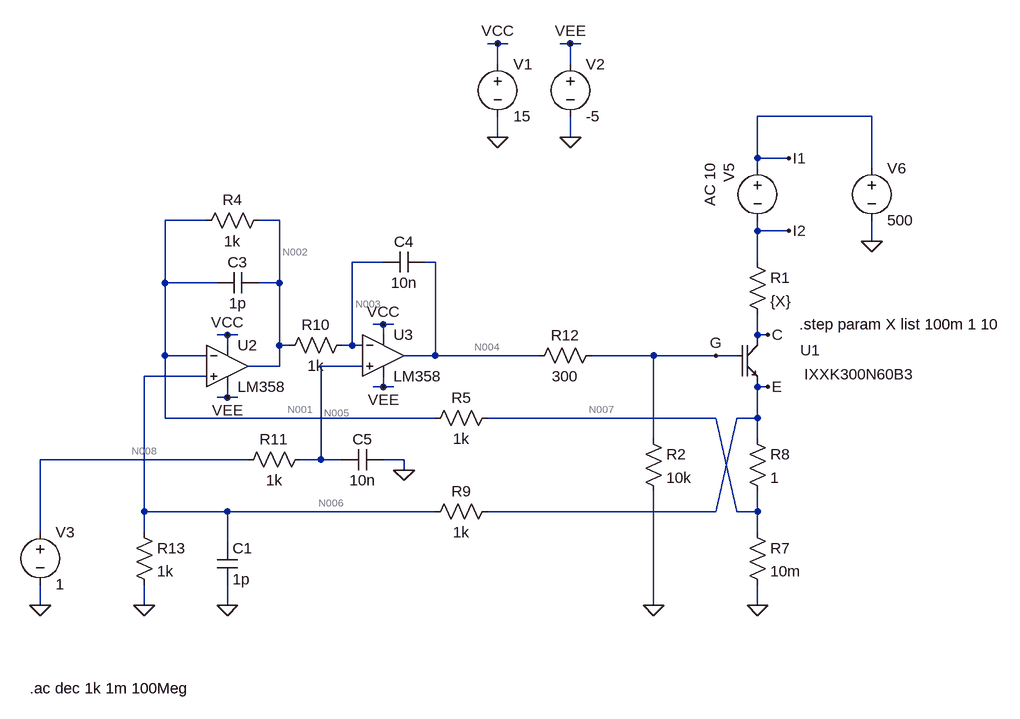
[diagram p0: schematic ConstantCurrentOutputFrequencyResponse.asc]
ConstantCurrentOutputFrequencyResponse.asc, the LTspice schematic file:
Version 4
SHEET 1 880 980
WIRE -160 -336 -176 -336
WIRE -144 -336 -160 -336
WIRE -48 -336 -64 -336
WIRE -32 -336 -48 -336
WIRE -160 -304 -160 -336
WIRE -48 -304 -48 -336
WIRE 416 -224 240 -224
WIRE -160 -192 -160 -224
WIRE -48 -192 -48 -224
WIRE 240 -160 240 -224
WIRE 288 -160 240 -160
WIRE 240 -144 240 -160
WIRE 416 -144 416 -224
WIRE -608 -64 -672 -64
WIRE -496 -64 -528 -64
WIRE 240 -48 240 -64
WIRE 288 -48 240 -48
WIRE 416 -32 416 -64
WIRE -336 0 -384 0
WIRE -256 0 -272 0
WIRE 240 0 240 -48
WIRE -672 32 -672 -64
WIRE -592 32 -672 32
WIRE -496 32 -496 -64
WIRE -496 32 -528 32
WIRE -336 96 -352 96
WIRE -320 96 -336 96
WIRE -576 112 -592 112
WIRE -560 112 -576 112
WIRE -336 112 -336 96
WIRE 240 112 240 80
WIRE 256 112 240 112
WIRE -576 128 -576 112
WIRE -496 128 -496 32
WIRE -480 128 -496 128
WIRE -384 128 -384 0
WIRE -384 128 -400 128
WIRE -368 128 -384 128
WIRE -672 144 -672 32
WIRE -608 144 -672 144
WIRE -256 144 -256 0
WIRE -256 144 -304 144
WIRE -96 144 -256 144
WIRE 80 144 -16 144
WIRE 176 144 80 144
WIRE 208 144 176 144
WIRE -496 160 -496 128
WIRE -496 160 -544 160
WIRE -368 160 -432 160
WIRE -608 176 -704 176
WIRE -336 192 -336 176
WIRE -336 192 -352 192
WIRE -320 192 -336 192
WIRE 256 192 240 192
WIRE -576 208 -576 192
WIRE -576 208 -592 208
WIRE -560 208 -576 208
WIRE -672 240 -672 144
WIRE -256 240 -672 240
WIRE 176 240 -176 240
WIRE 240 240 240 192
WIRE 240 240 208 240
WIRE 80 272 80 144
WIRE 240 272 240 240
WIRE -544 304 -864 304
WIRE -432 304 -432 160
WIRE -432 304 -464 304
WIRE -400 304 -432 304
WIRE -304 304 -336 304
WIRE -304 320 -304 304
WIRE -704 384 -704 176
WIRE -576 384 -704 384
WIRE -256 384 -576 384
WIRE 176 384 208 240
WIRE 176 384 -176 384
WIRE 208 384 176 240
WIRE 240 384 240 352
WIRE 240 384 208 384
WIRE -864 416 -864 304
WIRE -704 416 -704 384
WIRE 240 416 240 384
WIRE -576 432 -576 384
WIRE -864 528 -864 496
WIRE -704 528 -704 496
WIRE -576 528 -576 496
WIRE 80 528 80 352
WIRE 240 528 240 496
FLAG 240 528 0
FLAG -48 -192 0
FLAG -160 -192 0
FLAG -576 112 VCC
FLAG -576 208 VEE
FLAG -48 -336 VEE
FLAG -160 -336 VCC
FLAG 256 192 E
FLAG 256 112 C
FLAG 176 144 G
FLAG -336 96 VCC
FLAG -336 192 VEE
FLAG -864 528 0
FLAG 80 528 0
FLAG -704 528 0
FLAG -576 528 0
FLAG -304 320 0
FLAG 416 -32 0
FLAG 288 -160 I1
FLAG 288 -48 I2
SYMBOL IXXK300N60B3 240 144 R0
WINDOW 3 156 13 Top 2
WINDOW 0 81 7 Bottom 2
SYMATTR InstName U1
SYMBOL res 224 -16 R0
SYMATTR InstName R1
SYMATTR Value {X}
SYMBOL res 64 256 R0
SYMATTR InstName R2
SYMATTR Value 10k
SYMBOL LM358 -576 160 R0
SYMATTR InstName U2
SYMBOL voltage -160 -320 R0
WINDOW 123 0 0 Left 0
WINDOW 39 0 0 Left 0
SYMATTR InstName V1
SYMATTR Value 15
SYMBOL voltage -48 -320 R0
WINDOW 123 0 0 Left 0
WINDOW 39 0 0 Left 0
SYMATTR InstName V2
SYMATTR Value -5
SYMBOL voltage -864 400 R0
WINDOW 123 0 0 Left 0
WINDOW 39 0 0 Left 0
SYMATTR InstName V3
SYMATTR Value 1
SYMBOL res -160 224 R90
WINDOW 0 0 56 VBottom 2
WINDOW 3 32 56 VTop 2
SYMATTR InstName R5
SYMATTR Value 1k
SYMBOL res 224 256 R0
SYMATTR InstName R8
SYMATTR Value 1
SYMBOL cap -528 16 R90
WINDOW 0 0 32 VBottom 2
WINDOW 3 32 32 VTop 2
SYMATTR InstName C3
SYMATTR Value 1p
SYMBOL res -512 -80 R90
WINDOW 0 0 56 VBottom 2
WINDOW 3 32 56 VTop 2
SYMATTR InstName R4
SYMATTR Value 1k
SYMBOL LM358 -336 144 R0
SYMATTR InstName U3
SYMBOL voltage 240 -160 R0
WINDOW 0 -44 8 VRight 2
WINDOW 123 -73 8 VRight 2
WINDOW 39 0 0 Left 0
SYMATTR InstName V5
SYMATTR Value2 AC 10
SYMATTR Value ""
SYMBOL res -160 368 R90
WINDOW 0 0 56 VBottom 2
WINDOW 3 32 56 VTop 2
SYMATTR InstName R9
SYMATTR Value 1k
SYMBOL res -720 400 R0
SYMATTR InstName R13
SYMATTR Value 1k
SYMBOL cap -592 432 R0
SYMATTR InstName C1
SYMATTR Value 1p
SYMBOL cap -272 -16 R90
WINDOW 0 0 32 VBottom 2
WINDOW 3 32 32 VTop 2
SYMATTR InstName C4
SYMATTR Value 10n
SYMBOL res -384 112 R90
WINDOW 0 0 56 VBottom 2
WINDOW 3 32 56 VTop 2
SYMATTR InstName R10
SYMATTR Value 1k
SYMBOL res -448 288 R90
WINDOW 0 0 56 VBottom 2
WINDOW 3 32 56 VTop 2
SYMATTR InstName R11
SYMATTR Value 1k
SYMBOL cap -336 288 R90
WINDOW 0 0 32 VBottom 2
WINDOW 3 32 32 VTop 2
SYMATTR InstName C5
SYMATTR Value 10n
SYMBOL voltage 416 -160 R0
WINDOW 123 0 0 Left 0
WINDOW 39 0 0 Left 0
SYMATTR InstName V6
SYMATTR Value 500
SYMBOL res 224 400 R0
SYMATTR InstName R7
SYMATTR Value 10m
SYMBOL res 0 128 R90
WINDOW 0 0 56 VBottom 2
WINDOW 3 32 56 VTop 2
SYMATTR InstName R12
SYMATTR Value 300
TEXT -880 656 Left 2 !.ac dec 1k 1m 100Meg
TEXT 304 96 Left 2 !.step param X list 100m 1 10

The netlist it stands for:
* ConstantCurrentOutputFrequencyResponse.asc
XU1 C G E IXXK300N60B3 IXXK300N60B3  ; pins C G E
R1 I2 C {X}
R2 G 0 10k
* U2: LM358 (symbol LM358 not available, pins judged from their places): In+=N006 In-=N001 V+=VCC V-=VEE OUT=N002
V1 VCC 0 15
V2 VEE 0 -5
V3 N008 0 1
R5 N007 N001 1k
R8 E N007 1
C3 N002 N001 1p
R4 N002 N001 1k
* U3: LM358 (symbol LM358 not available, pins judged from their places): In+=N005 In-=N003 V+=VCC V-=VEE OUT=N004
V5 I1 I2 AC 10
R9 E N006 1k
R13 N006 0 1k
C1 N006 0 1p
C4 N004 N003 10n
R10 N003 N002 1k
R11 N005 N008 1k
C5 0 N005 10n
V6 I1 0 500
R7 N007 0 10m
R12 G N004 300
.ac dec 1k 1m 100Meg
.step param X list 100m 1 10
.lib ixxk300n60b3.lib
.backanno
.end

* Results of the author's LTspice run, read from the files saved beside the schematic
* Operating Point (first step), zero values left out:
*   x = 100 m
*   V(c) = 499.9 V
*   V(e) = 1.01 V
*   V(g) = 7.204 V
*   V(i2) = 500 V
*   V(n006) = 505 mV
*   V(vee) = -5 V
*   V(n001) = 505 mV
*   V(vcc) = 15 V
*   V(n002) = 1 V
*   V(n008) = 1 V
*   V(n007) = 10 mV
*   V(n005) = 1 V
*   V(n003) = 1 V
*   V(n004) = 7.42 V
*   V(i1) = 500 V
*   I(R1) = 1 A
*   I(R2) = 720.4 µA
*   I(R5) = -495 µA
*   I(R8) = 999.9 mA
*   I(R4) = 495 µA
*   I(R9) = 504.9 µA
*   I(R13) = 505 µA
*   I(R10) = 10 nA
*   I(R11) = 9.996 nA
*   I(R7) = 1 A
*   I(R12) = -720.4 µA
*   I(V1) = -685.9 µA
*   I(V2) = -529.5 µA
*   I(V3) = 9.996 nA
*   I(V5) = 1 A
*   I(V6) = -1 A
*   Ix(u1:C) = 1 A
*   Ix(u1:E) = -1 A
*   Ix(u2:1) = -9.994 nA
*   Ix(u2:2) = -10.01 nA
*   Ix(u2:3) = -495 µA
*   Ix(u2:4) = 343.8 µA
*   Ix(u2:5) = 151.2 µA
*   Ix(u3:1) = -10 nA
*   Ix(u3:2) = -9.996 nA
*   Ix(u3:3) = -720.4 µA
*   Ix(u3:4) = 342.1 µA
*   Ix(u3:5) = 378.3 µA